# EAGLE design MKS V5 SMOOTHER v2 (EAGLE 9.3.2)
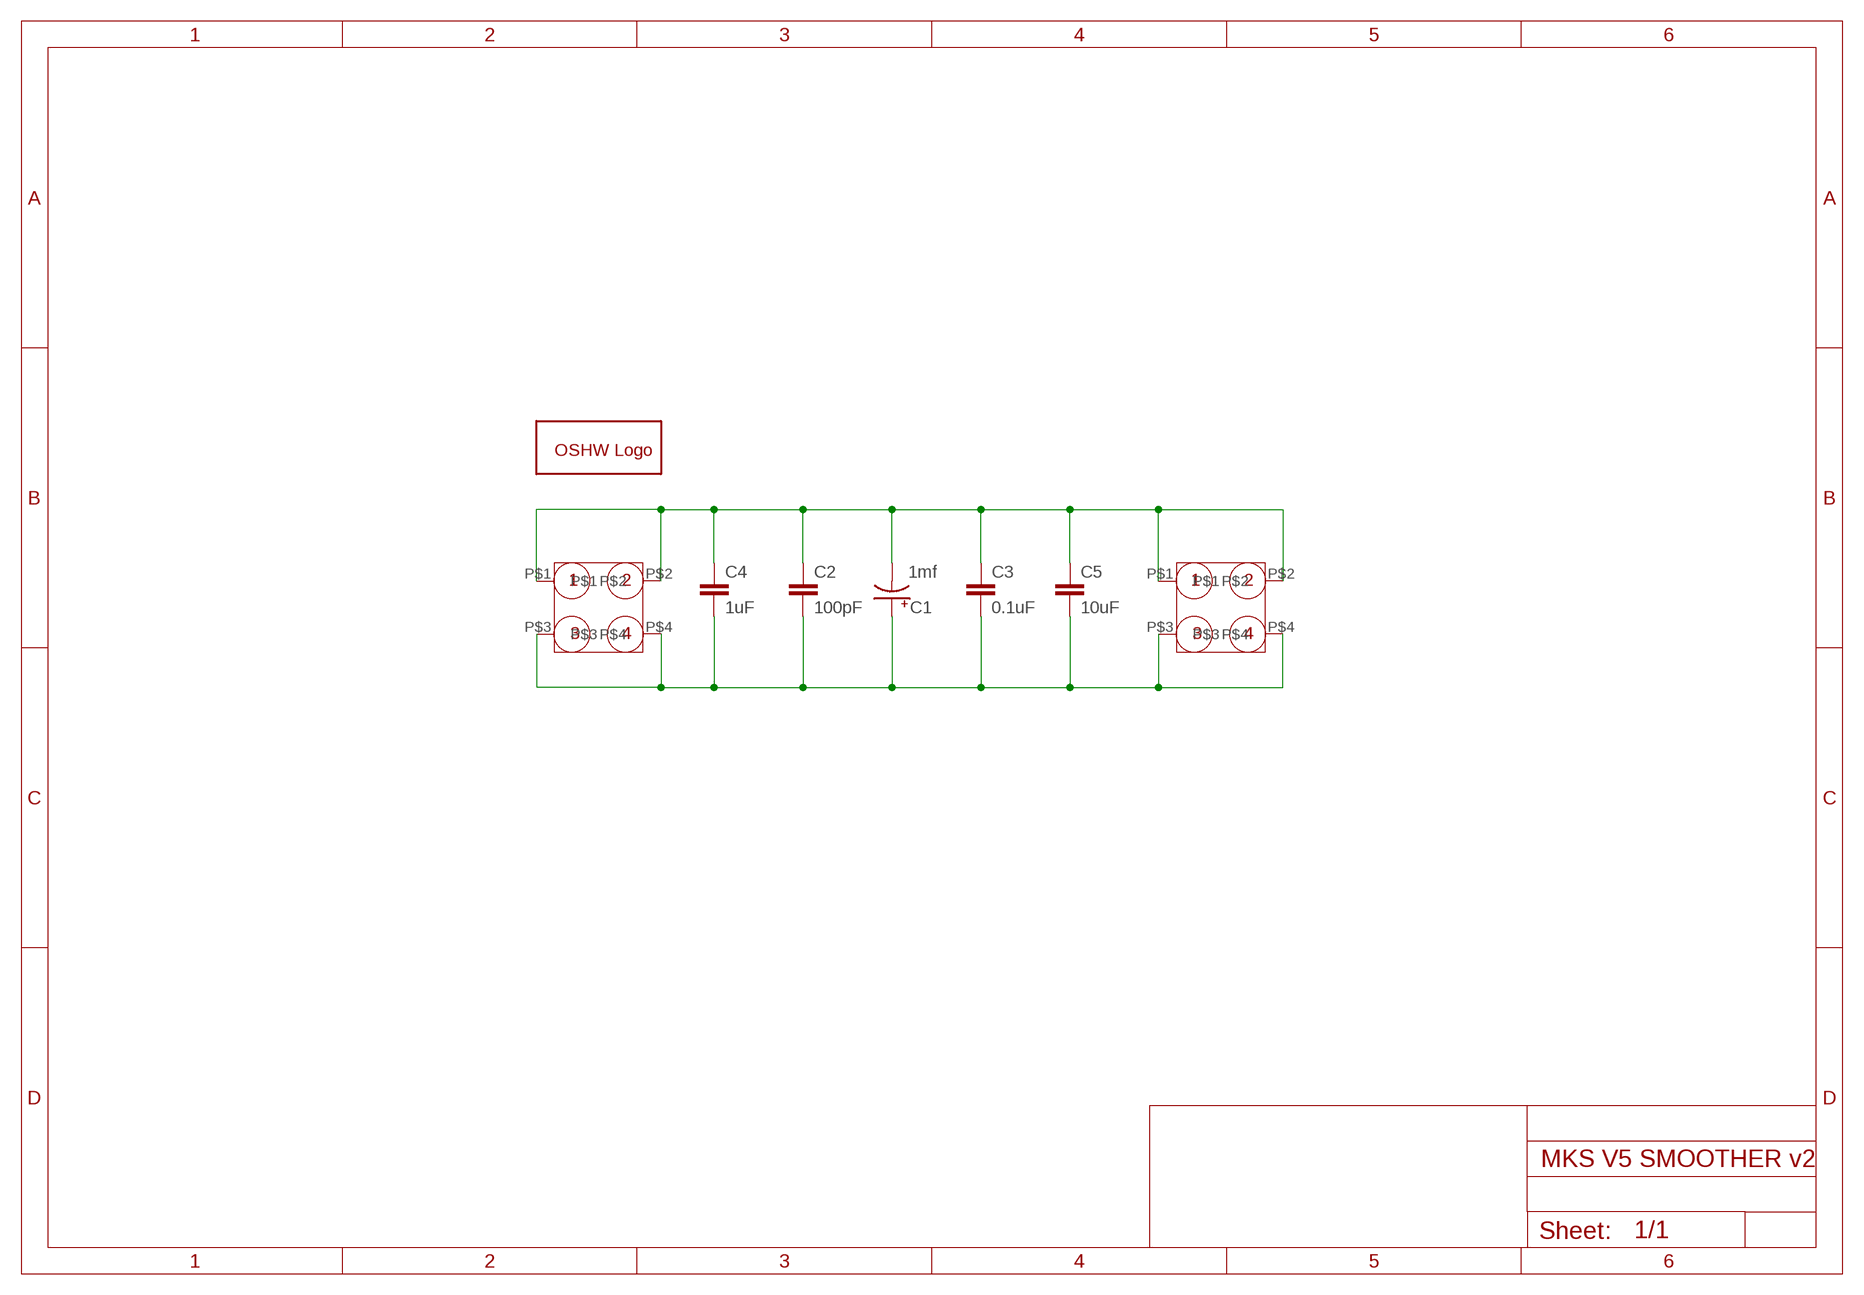
[diagram p0: schematic, sheet 1]

## Parts
C1  1mf  1000UF-RADIAL-5MM-35V-20%-KIT  [CPOL-RADIAL-5MM-10MM-KIT]
C2  100pF  100PF-0603-50V-5%  [0603]
C3  0.1uF  0.1UF-0603-100V-10%  [0603]
C4  1uF  C-EUC0805K  [C0805K]
C5  10uF  C-EUC0805K  [C0805K]
GOLD_ORB_SM1  OSHWLOGOLOGO5MM  [OSHW_5MM]
U$1  4BLOCK254  [4BLOCK254]
U$2  4BLOCK254  [4BLOCK254]

## Nets
N$2: C1.- C2.1 C3.1 C4.1 C5.1 U$1.P$1 U$1.P$2 U$2.P$1 U$2.P$2
N$4: C1.+ C2.2 C3.2 C4.2 C5.2 U$1.P$3 U$1.P$4 U$2.P$3 U$2.P$4

## Library data of the parts
C1 = SparkFun-Capacitors:1000UF: 1,000µF/1mF ceramic capacitors A capacitor is a passive two-terminal electrical component used to store electrical energy temporarily in an electric field. CAP-08070; PROD_ID: CAP-09538
C2 = SparkFun-Capacitors:100PF: 100pF/0.1nF ceramic capacitors A capacitor is a passive two-terminal electrical component used to store electrical energy temporarily in an electric field.; PROD_ID: CAP-07883
C3 = SparkFun-Capacitors:0.1UF: 0.1µF ceramic capacitors A capacitor is a passive two-terminal electrical component used to store electrical energy temporarily in an electric field.; PROD_ID: CAP-08390
C4 C5 = rcl:C-EU: CAPACITOR, European symbol; SPICEPREFIX: C
GOLD_ORB_SM1 = oshw:OSHWLOGO: The OSHW logo for PCB layout
U$1 U$2 = 4BLOCK254:4BLOCK254

## Board
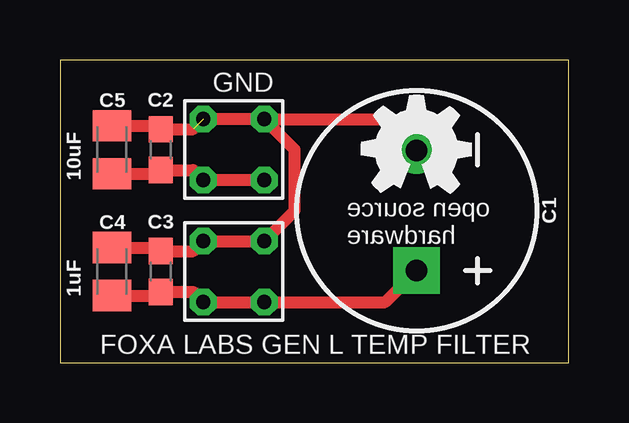
[diagram p1: board, top side]
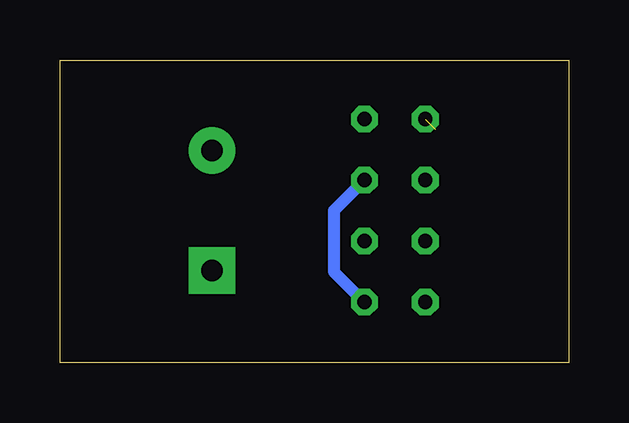
[diagram p2: board, bottom side, seen from below]

Size 21.19 x 12.62 mm. Coordinates in mm from the lower left corner, seen from the top.
Outline: 0,0 21.19,0 21.19,12.62 0,12.62 0,0
Copper layers (1*16): Top 0.035mm / dielectric 1.5mm / Bottom 0.035mm
Design rules "default *": minimum track width 20mil, minimum drill 0.35mm, track to track 12mil, track to pad 12mil, pad to pad 12mil, via to via 12mil, smd to smd 12mil, copper to edge 40mil, drill to drill 6mil, minimum pad ring 10mil, minimum via ring 8mil, stop-mask expansion 4mil, vias tented up to drill 0mil, thermal gap 10mil

### Footprints (pad centres in the part's own frame; a part is rotated, then mirrored left to right if it is on the bottom)
CPOL-RADIAL-5MM-10MM-KIT = drill 0.9 pad 1.93 square: + 2.5,0 | drill 0.9 pad 1.93: - -2.5,0
0603 = smd 1.1 x 1: 1 -0.85,0; 2 0.85,0
C0805K = smd 1.3 x 1.6: 1 -1,0; 2 1,0
4BLOCK254 = drill 0.6 octagon: P$1 0,0; P$2 2.54,0; P$3 2.54,-2.54; P$4 0,-2.54

### Placement (x,y rotation side)
C1  14.86,6.35 270 top
C2  4.19,8.89 270 top
C3  4.19,3.81 270 top
C4  2.16,3.81 270 top
C5  2.16,8.89 270 top
GOLD_ORB_SM1  14.86,8.89 0 bottom
U$1  5.97,5.08 0 top
U$2  5.97,10.16 0 top

### Tracks (layer width: path | path; a pad name or v marks a point on that pad's centre or on a via)
N$2  (1 unrouted)
  Top 0.508: C5.1 4.04,9.89 C2.1 5.55,9.74 | U$2.P$2 13.55,10.16 C1.- | U$2.P$2 9.78,8.89 9.78,6.35 U$1.P$2 U$1.P$1 5.55,4.66 C3.1 4.04,4.81 C4.1 | U$2.P$2 U$2.P$1
N$4
  Top 0.508: C5.2 4.04,7.89 C2.2 5.55,8.04 U$2.P$4 U$2.P$3 | C1.+ 13.55,2.54 U$1.P$3 U$1.P$4 5.55,2.96 C3.2 4.04,2.81 C4.2
  Bottom 0.508: U$1.P$3 9.78,3.81 9.78,6.35 U$2.P$3

### Text on the board
tPlace: GND | FOXA LABS GEN L TEMP FILTER